# Altium schematic sheet SheetMain.SchDoc: NekoCart Schematic
size A3; DrawnBy: ZephRay; Engineer: ZephRay; Address1: www.zephray.com; Address2: zephray@outlook.com; DocumentNumber: 1; Revision: R1; SheetNumber: 1; DocumentName: NekoCart; ProjectName: NekoCart
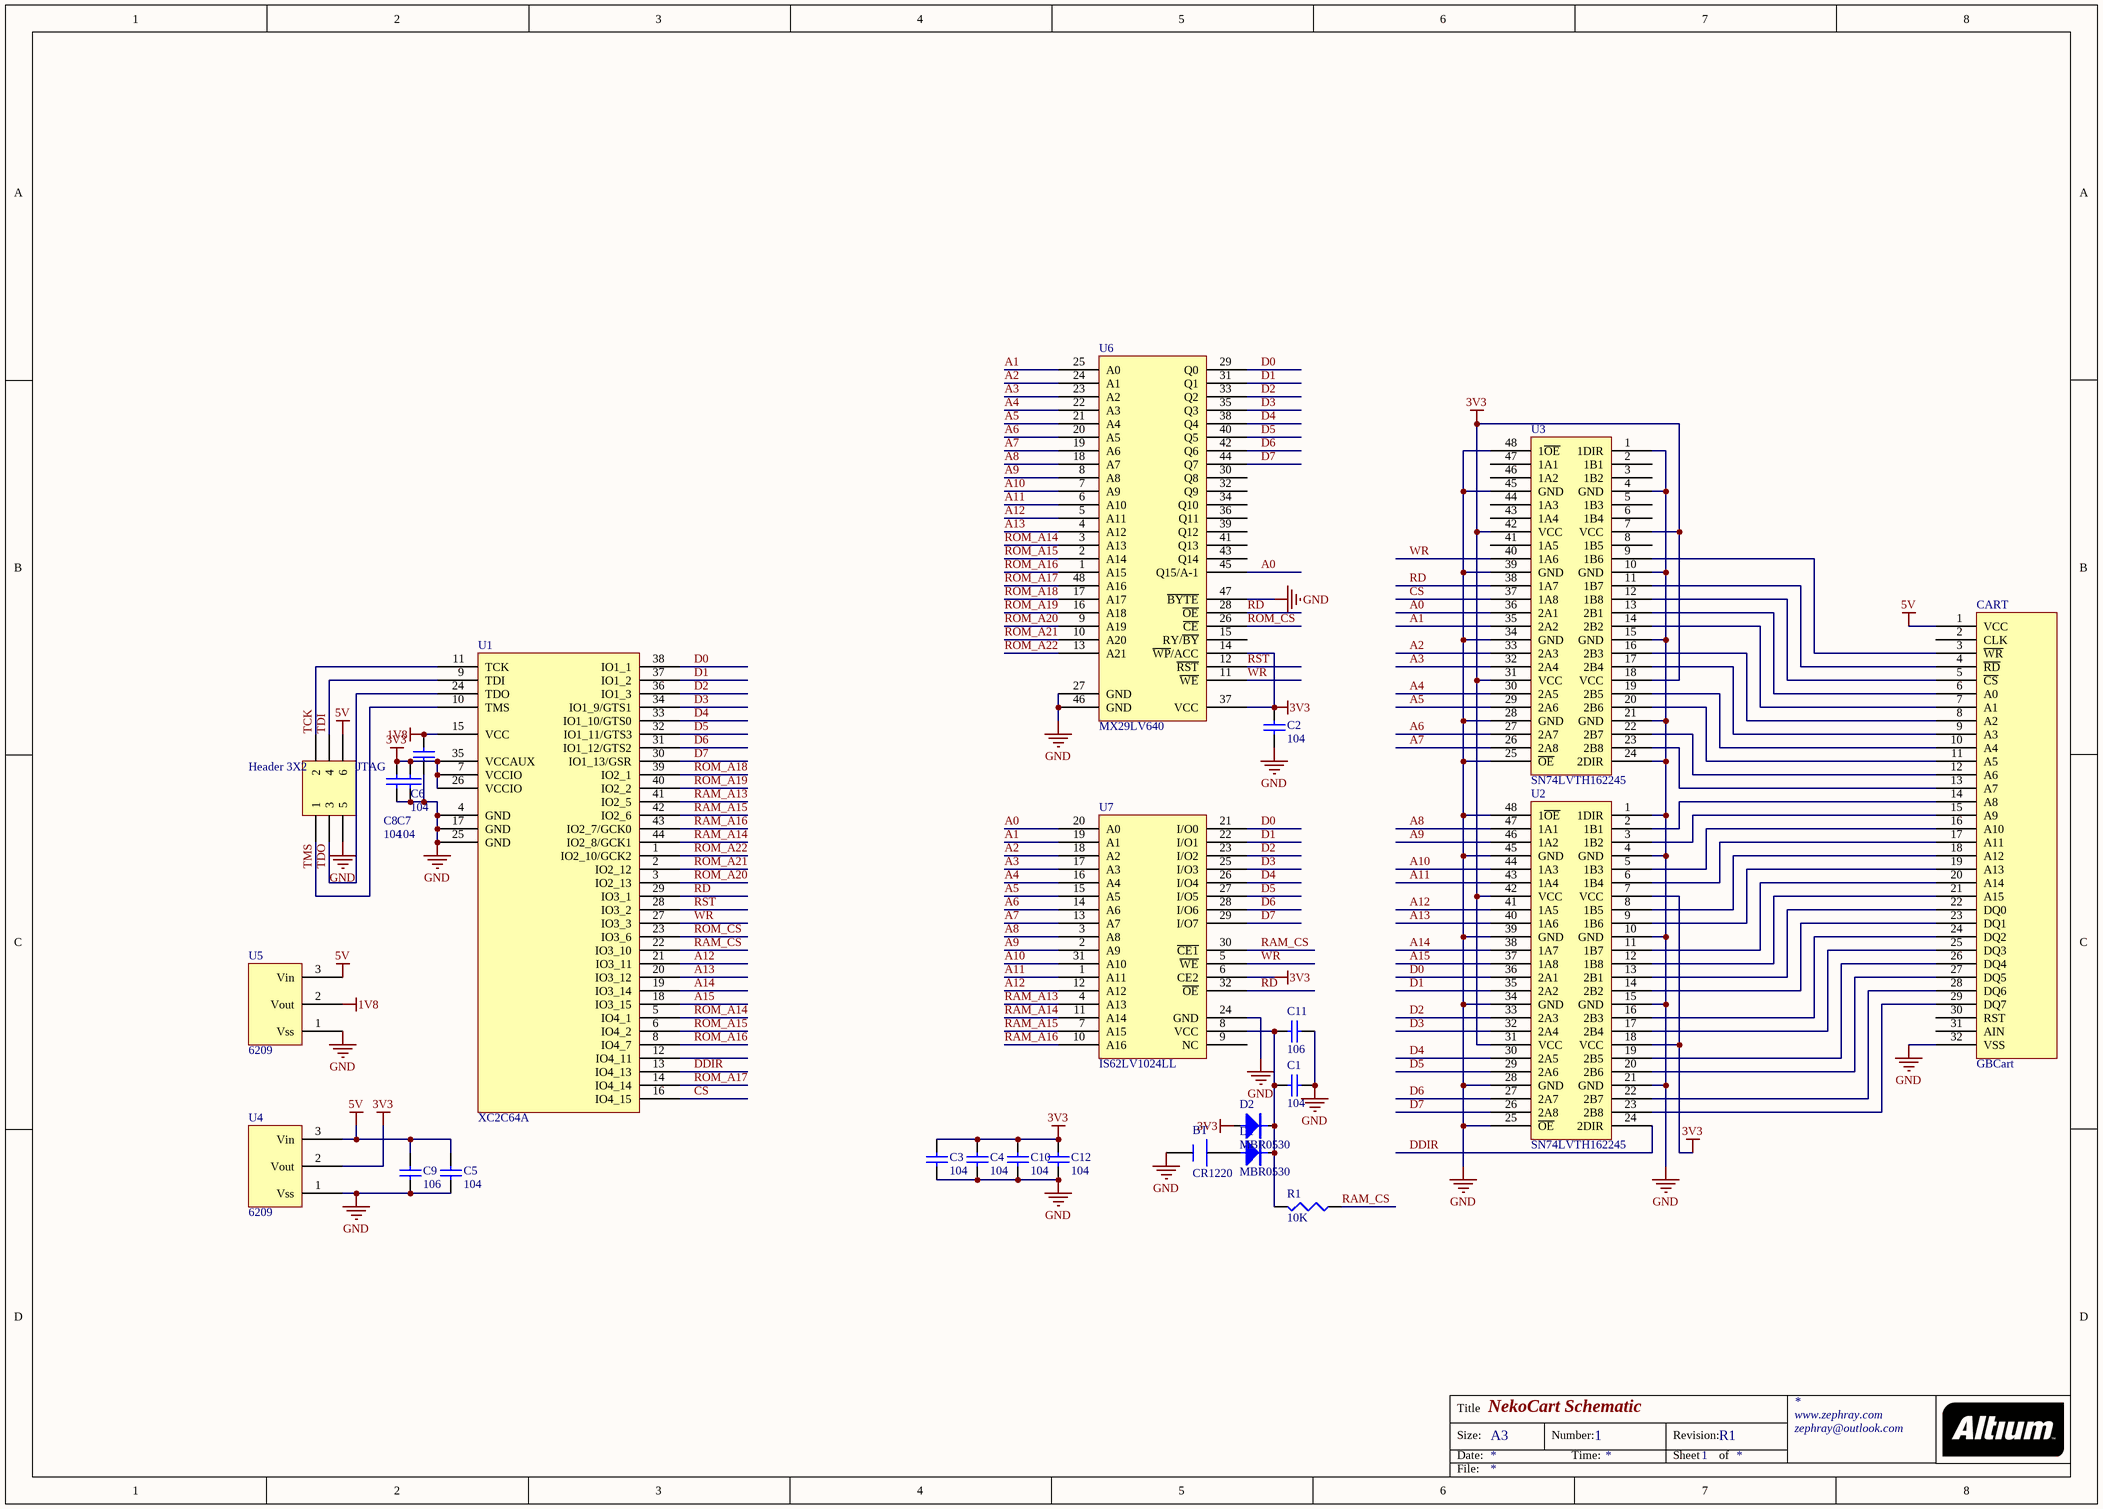
[diagram p0: SheetMain.SchDoc]

## Parts
BT  CR1220  [CR1220]
C1  104  [1608[0603]]
C2  104  [1608[0603]]
C3  104  [1608[0603]]
C4  104  [1608[0603]]
C5  104  [1608[0603]]
C6  104  [1608[0603]]
C7  104  [1608[0603]]
C8  104  [1608[0603]]
C9  106  [C0805]
C10  104  [1608[0603]]
C11  106  [C0805]
C12  104  [1608[0603]]
CART  GBCart  [GB_CART]
D1  MBR0530  [0805D]
D2  MBR0530  [0805D]
JTAG  Header 3X2  [HDR2X3]
R1  10K  [J1-0603]
U1  XC2C64A  [44A_L]
U2  SN74LVTH162245  [TSOP48]
U3  SN74LVTH162245  [TSOP48]
U4  6209  [SOT-23]
U5  6209  [SOT-23]
U6  MX29LV640  [TSOP48L]
U7  IS62LV1024LL  [TSOP32]

## Nets
1V8: C6.2 U1.15(VCC) U5.2(Vout)
3V3: C2.2 C3.2 C4.2 C7.2 C8.2 C10.1 C12.2 D2.A U1.7(VCCIO) U1.26(VCCIO) U1.35(VCCAUX) U2.7(VCC) U2.18(VCC) U2.31(VCC) U2.42(VCC) U3.7(VCC) U3.18(VCC) U3.31(VCC) U3.42(VCC) U4.2(Vout) U6.14(~{WP}/ACC) U6.37(VCC) U7.6(CE2)
5V: C5.2 C9.2 CART.1(VCC) JTAG.6 U4.3(Vin) U5.3(Vin)
GND: BT.2(-) C1.1 C2.1 C3.1 C4.1 C5.1 C6.1 C7.1 C8.1 C9.1 C10.2 C11.1 C12.1 CART.32(VSS) JTAG.5 U1.4(GND) U1.17(GND) U1.25(GND) U2.1(1DIR) U2.4(GND) U2.10(GND) U2.15(GND) U2.21(GND) U2.25(~{OE}) U2.28(GND) U2.34(GND) U2.39(GND) U2.45(GND) U2.48(1~{OE}) U3.1(1DIR) U3.4(GND) U3.10(GND) U3.15(GND) U3.21(GND) U3.24(2DIR) U3.25(~{OE}) U3.28(GND) U3.34(GND) U3.39(GND) U3.45(GND) U3.48(1~{OE}) U4.1(Vss) U5.1(Vss) U6.27(GND) U6.46(GND) U6.47(~{BYTE}) U7.24(GND)
A0: U3.36(2A1) U6.45(Q15/A-1) U7.20(A0)
A1: U3.35(2A2) U6.25(A0) U7.19(A1)
A2: U3.33(2A3) U6.24(A1) U7.18(A2)
A3: U3.32(2A4) U6.23(A2) U7.17(A3)
A4: U3.30(2A5) U6.22(A3) U7.16(A4)
A5: U3.29(2A6) U6.21(A4) U7.15(A5)
A6: U3.27(2A7) U6.20(A5) U7.14(A6)
A7: U3.26(2A8) U6.19(A6) U7.13(A7)
A8: U2.47(1A1) U6.18(A7) U7.3(A8)
A9: U2.46(1A2) U6.8(A8) U7.2(A9)
A10: U2.44(1A3) U6.7(A9) U7.31(A10)
A11: U2.43(1A4) U6.6(A10) U7.1(A11)
A12: U1.21(IO3_11) U2.41(1A5) U6.5(A11) U7.12(A12)
A13: U1.20(IO3_12) U2.40(1A6) U6.4(A12)
A14: U1.19(IO3_14) U2.38(1A7)
A15: U1.18(IO3_15) U2.37(1A8)
CS: U1.16(IO4_15) U3.37(1A8)
D0: U1.38(IO1_1) U2.36(2A1) U6.29(Q0) U7.21(I/O0)
D1: U1.37(IO1_2) U2.35(2A2) U6.31(Q1) U7.22(I/O1)
D2: U1.36(IO1_3) U2.33(2A3) U6.33(Q2) U7.23(I/O2)
D3: U1.34(IO1_9/GTS1) U2.32(2A4) U6.35(Q3) U7.25(I/O3)
D4: U1.33(IO1_10/GTS0) U2.30(2A5) U6.38(Q4) U7.26(I/O4)
D5: U1.32(IO1_11/GTS3) U2.29(2A6) U6.40(Q5) U7.27(I/O5)
D6: U1.31(IO1_12/GTS2) U2.27(2A7) U6.42(Q6) U7.28(I/O6)
D7: U1.30(IO1_13/GSR) U2.26(2A8) U6.44(Q7) U7.29(I/O7)
DDIR: U1.13(IO4_13) U2.24(2DIR)
RAM_A13: U1.41(IO2_5) U7.4(A13)
RAM_A14: U1.44(IO2_8/GCK1) U7.11(A14)
RAM_A15: U1.42(IO2_6) U7.7(A15)
RAM_A16: U1.43(IO2_7/GCK0) U7.10(A16)
RAM_CS: R1.1 U1.22(IO3_10) U7.30(~{CE1})
RD: U1.29(IO3_1) U3.38(1A7) U6.28(~{OE}) U7.32(~{OE})
ROM_A14: U1.5(IO4_1) U6.3(A13)
ROM_A15: U1.6(IO4_2) U6.2(A14)
ROM_A16: U1.8(IO4_7) U6.1(A15)
ROM_A17: U1.14(IO4_14) U6.48(A16)
ROM_A18: U1.39(IO2_1) U6.17(A17)
ROM_A19: U1.40(IO2_2) U6.16(A18)
ROM_A20: U1.3(IO2_13) U6.9(A19)
ROM_A21: U1.2(IO2_12) U6.10(A20)
ROM_A22: U1.1(IO2_10/GCK2) U6.13(A21)
ROM_CS: U1.23(IO3_6) U6.26(~{CE})
RST: U1.28(IO3_2) U6.12(~{RST})
TCK: JTAG.2 U1.11(TCK)
TDI: JTAG.4 U1.9(TDI)
TDO: JTAG.3 U1.24(TDO)
TMS: JTAG.1 U1.10(TMS)
WR: U1.27(IO3_3) U3.40(1A6) U6.11(~{WE}) U7.5(~{WE})
NetBT_1: BT.1(+) D1.A
NetC1_2: C1.2 C11.2 D1.K D2.K R1.2 U7.8(VCC)
NetCART_3: CART.3(~{WR}) U3.9(1B6)
NetCART_4: CART.4(~{RD}) U3.11(1B7)
NetCART_5: CART.5(~{CS}) U3.12(1B8)
NetCART_6: CART.6(A0) U3.13(2B1)
NetCART_7: CART.7(A1) U3.14(2B2)
NetCART_8: CART.8(A2) U3.16(2B3)
NetCART_9: CART.9(A3) U3.17(2B4)
NetCART_10: CART.10(A4) U3.19(2B5)
NetCART_11: CART.11(A5) U3.20(2B6)
NetCART_12: CART.12(A6) U3.22(2B7)
NetCART_13: CART.13(A7) U3.23(2B8)
NetCART_14: CART.14(A8) U2.2(1B1)
NetCART_15: CART.15(A9) U2.3(1B2)
NetCART_16: CART.16(A10) U2.5(1B3)
NetCART_17: CART.17(A11) U2.6(1B4)
NetCART_18: CART.18(A12) U2.8(1B5)
NetCART_19: CART.19(A13) U2.9(1B6)
NetCART_20: CART.20(A14) U2.11(1B7)
NetCART_21: CART.21(A15) U2.12(1B8)
NetCART_22: CART.22(DQ0) U2.13(2B1)
NetCART_23: CART.23(DQ1) U2.14(2B2)
NetCART_24: CART.24(DQ2) U2.16(2B3)
NetCART_25: CART.25(DQ3) U2.17(2B4)
NetCART_26: CART.26(DQ4) U2.19(2B5)
NetCART_27: CART.27(DQ5) U2.20(2B6)
NetCART_28: CART.28(DQ6) U2.22(2B7)
NetCART_29: CART.29(DQ7) U2.23(2B8)

Not connected (* = marked no-connect by the designer): CART 2(CLK) 30(RST) 31(AIN); U1 12(IO4_11); U3 2(1B1) 3(1B2) 5(1B3) 6(1B4) 8(1B5) 41(1A5) 43(1A4) 44(1A3) 46(1A2) 47(1A1); U6 15(RY/~{BY}) 30(Q8) 32(Q9) 34(Q10) 36(Q11) 39(Q12) 41(Q13) 43(Q14); U7 9(NC)

## Notes on the sheet
- Title
- Size:
- Date:
- A3
- Number:
- Time:
- Revision:
- Sheet
- of
- File:

## Library data of the parts
C1-C12 = Cap Semi: Capacitor (Semiconductor SIM Model); Value: 100pF; Published: 8-Jun-2000; LatestRevisionDate: 29-May-2009; LatestRevisionNote: IPC-7351 Footprint Added.; PackageReference: C1206; Publisher: Altium Limited; PackageDescription: Chip Capacitor
D1 D2 = 1N4148
JTAG = Header 3X2: Header, 3-Pin, Dual row; LatestRevisionDate: 17-Jul-2002; LatestRevisionNote: Re-released for DXP Platform.; Publisher: Altium Limited
R1 = Res3: Resistor; Published: 8-Jun-2000; LatestRevisionDate: 29-May-2009; LatestRevisionNote: IPC-7351 Footprint Added.; PackageReference: J1-0603; Publisher: Altium Limited; PackageDescription: Chip Resistor
BT = CR1220: Published: 24-Mar-1999; LatestRevisionDate: 17-Jul-2002; LatestRevisionNote: Re-released for DXP Platform.; PackageReference: BAT-2; Publisher: Altium Limited; PackageDescription: Battery; 2 Leads